# Altium schematic sheet XILINX ARTIX-7 FPGA A704 Motherboard_CON.SchDoc
size 420 x 297 mm
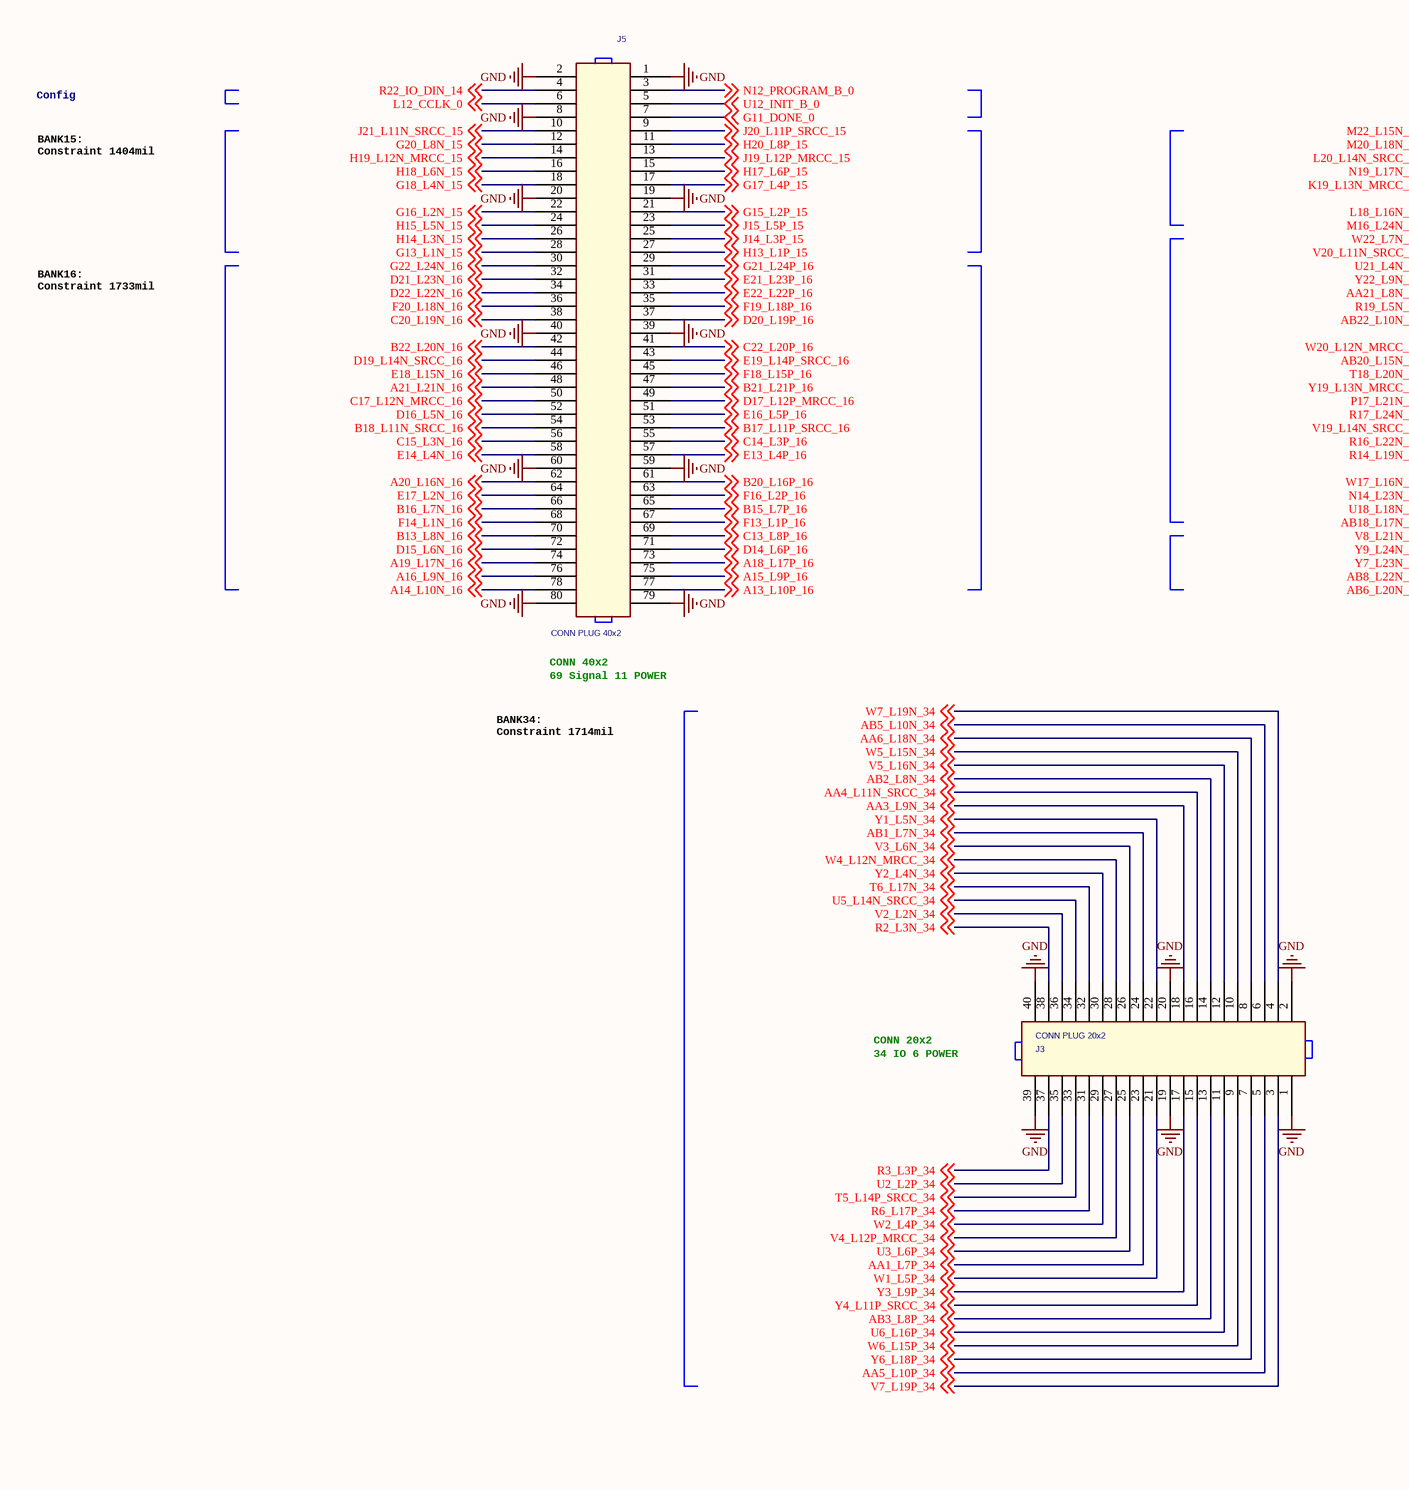
[diagram p0: XILINX ARTIX-7 FPGA A704 Motherboard_CON.SchDoc, left]
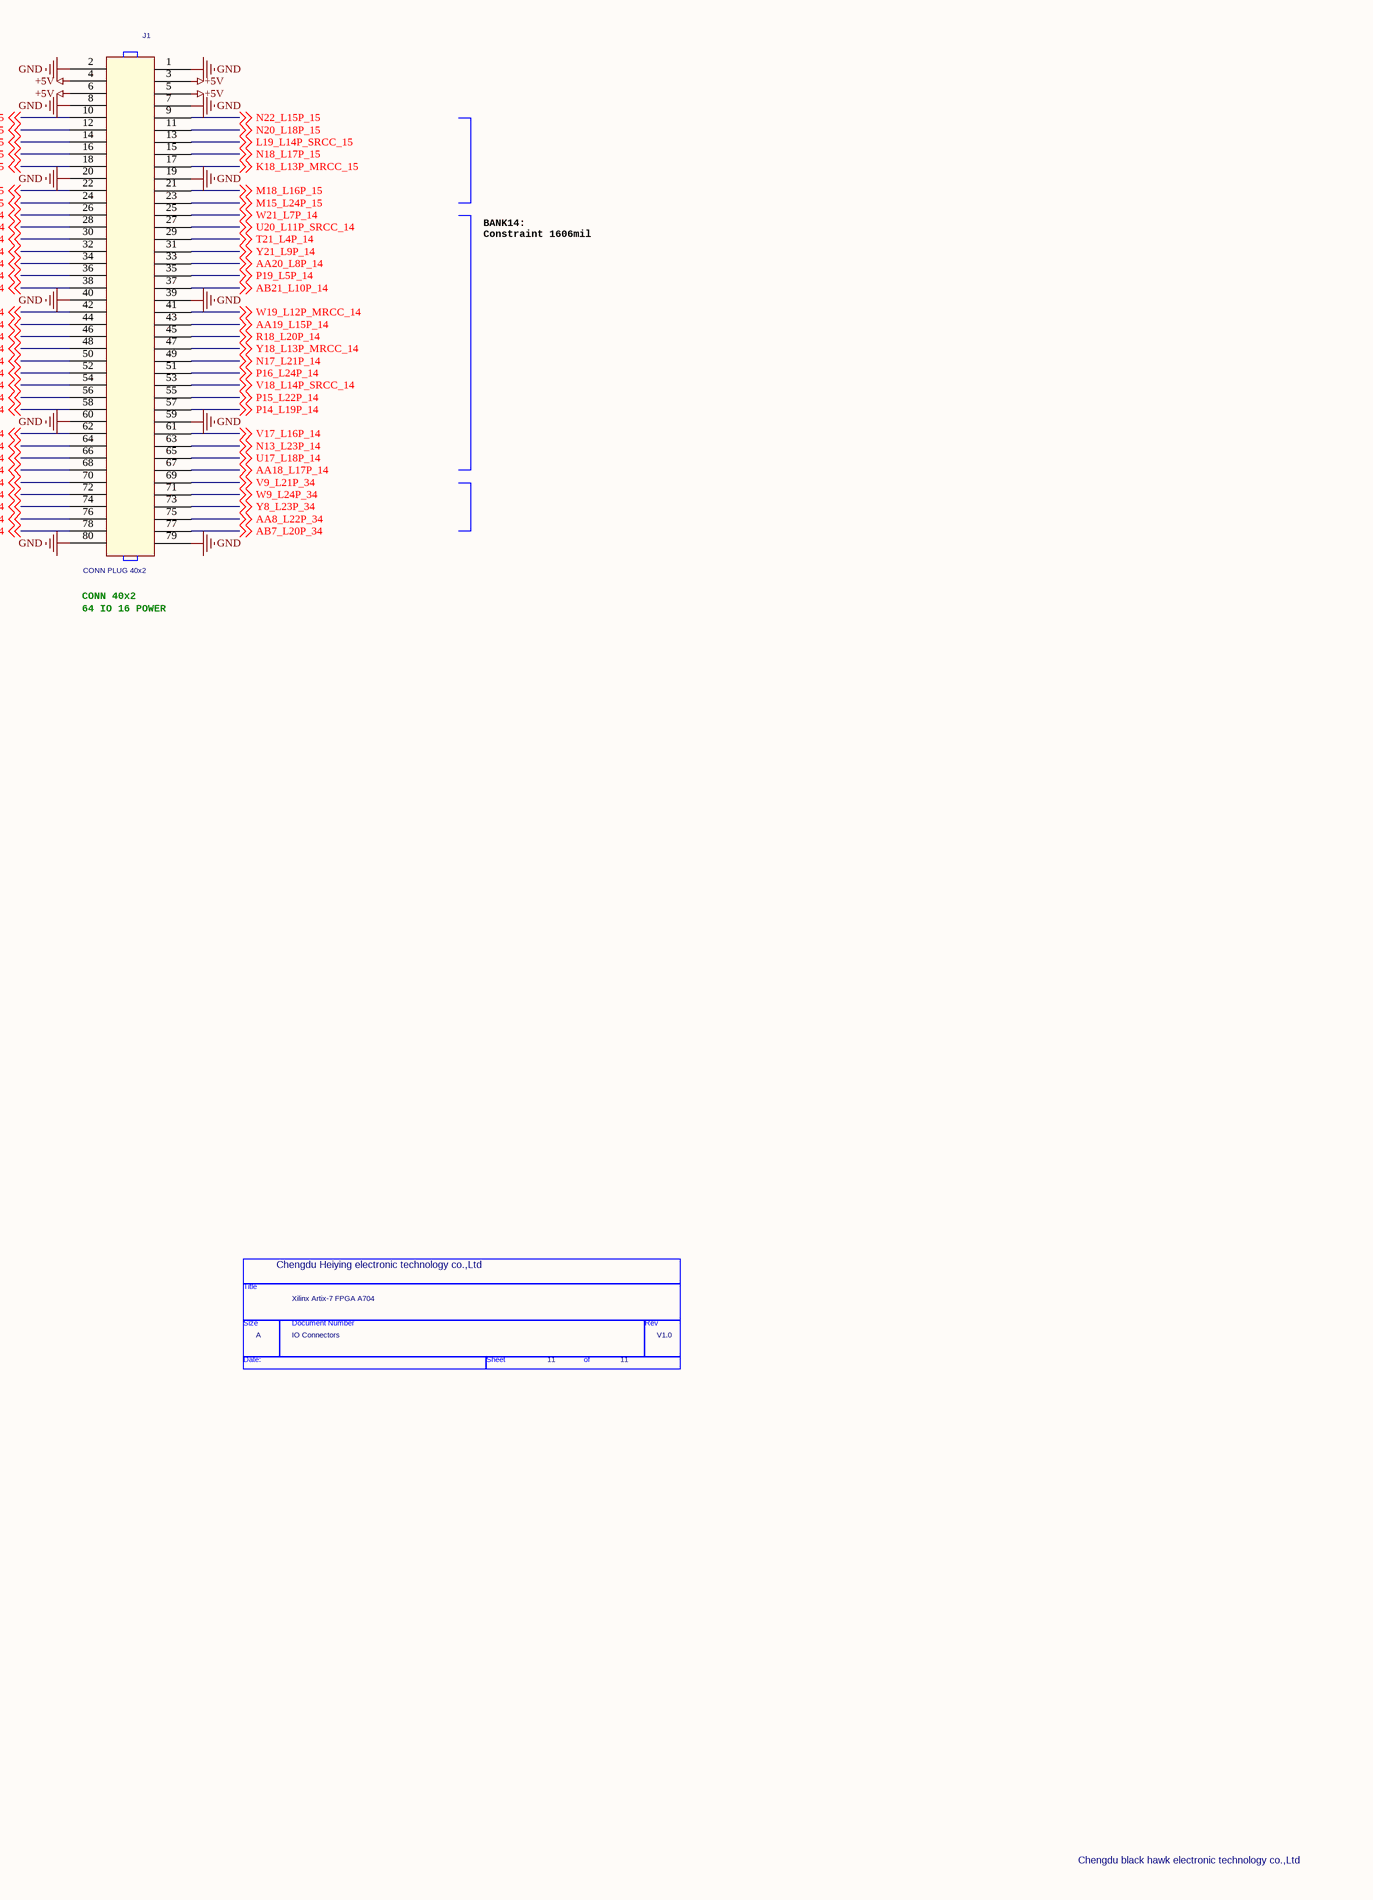
[diagram p1: XILINX ARTIX-7 FPGA A704 Motherboard_CON.SchDoc, right]

## Parts
*  Doc: IO Connectors  RevCode: V1.0  Title: Xilinx Artix-7 FPGA A704  Page Size: A  Page Number: 11  (hidden comment: TitleBlock0)  (graphical)
J1  CONN PLUG 40x2  [HDR2X40_2P0]
J3  CONN PLUG 20x2  [HDR2X20_2P0]
J5  CONN PLUG 40x2  [HDR2X40_2P0]

## Nets
+5V: J1.3 J1.4 J1.5 J1.6
GND: J1.1 J1.2 J1.7 J1.8 J1.19 J1.20 J1.39 J1.40 J1.59 J1.60 J1.79 J1.80 J3.1 J3.2 J3.19 J3.20 J3.39 J3.40 J5.1 J5.2 J5.8 J5.19 J5.20 J5.39 J5.40 J5.59 J5.60 J5.79 J5.80
A13_L10P_16: J5.77 ; off-sheet A13_L10P_16
A14_L10N_16: J5.78 ; off-sheet A14_L10N_16
A15_L9P_16: J5.75 ; off-sheet A15_L9P_16
A16_L9N_16: J5.76 ; off-sheet A16_L9N_16
A18_L17P_16: J5.73 ; off-sheet A18_L17P_16
A19_L17N_16: J5.74 ; off-sheet A19_L17N_16
A20_L16N_16: J5.62 ; off-sheet A20_L16N_16
A21_L21N_16: J5.48 ; off-sheet A21_L21N_16
AA1_L7P_34: J3.23 ; off-sheet AA1_L7P_34
AA3_L9N_34: J3.18 ; off-sheet AA3_L9N_34
AA4_L11N_SRCC_34: J3.16 ; off-sheet AA4_L11N_SRCC_34
AA5_L10P_34: J3.5 ; off-sheet AA5_L10P_34
AA6_L18N_34: J3.8 ; off-sheet AA6_L18N_34
AA8_L22P_34: J1.75 ; off-sheet AA8_L22P_34
AA18_L17P_14: J1.67 ; off-sheet AA18_L17P_14
AA19_L15P_14: J1.43 ; off-sheet AA19_L15P_14
AA20_L8P_14: J1.33 ; off-sheet AA20_L8P_14
AA21_L8N_14: J1.34 ; off-sheet AA21_L8N_14
AB1_L7N_34: J3.24 ; off-sheet AB1_L7N_34
AB2_L8N_34: J3.14 ; off-sheet AB2_L8N_34
AB3_L8P_34: J3.13 ; off-sheet AB3_L8P_34
AB5_L10N_34: J3.6 ; off-sheet AB5_L10N_34
AB6_L20N_34: J1.78 ; off-sheet AB6_L20N_34
AB7_L20P_34: J1.77 ; off-sheet AB7_L20P_34
AB8_L22N_34: J1.76 ; off-sheet AB8_L22N_34
AB18_L17N_14: J1.68 ; off-sheet AB18_L17N_14
AB20_L15N_14: J1.44 ; off-sheet AB20_L15N_14
AB21_L10P_14: J1.37 ; off-sheet AB21_L10P_14
AB22_L10N_14: J1.38 ; off-sheet AB22_L10N_14
B13_L8N_16: J5.70 ; off-sheet B13_L8N_16
B15_L7P_16: J5.65 ; off-sheet B15_L7P_16
B16_L7N_16: J5.66 ; off-sheet B16_L7N_16
B17_L11P_SRCC_16: J5.53 ; off-sheet B17_L11P_SRCC_16
B18_L11N_SRCC_16: J5.54 ; off-sheet B18_L11N_SRCC_16
B20_L16P_16: J5.61 ; off-sheet B20_L16P_16
B21_L21P_16: J5.47 ; off-sheet B21_L21P_16
B22_L20N_16: J5.42 ; off-sheet B22_L20N_16
C13_L8P_16: J5.69 ; off-sheet C13_L8P_16
C14_L3P_16: J5.55 ; off-sheet C14_L3P_16
C15_L3N_16: J5.56 ; off-sheet C15_L3N_16
C17_L12N_MRCC_16: J5.50 ; off-sheet C17_L12N_MRCC_16
C20_L19N_16: J5.38 ; off-sheet C20_L19N_16
C22_L20P_16: J5.41 ; off-sheet C22_L20P_16
D14_L6P_16: J5.71 ; off-sheet D14_L6P_16
D15_L6N_16: J5.72 ; off-sheet D15_L6N_16
D16_L5N_16: J5.52 ; off-sheet D16_L5N_16
D17_L12P_MRCC_16: J5.49 ; off-sheet D17_L12P_MRCC_16
D19_L14N_SRCC_16: J5.44 ; off-sheet D19_L14N_SRCC_16
D20_L19P_16: J5.37 ; off-sheet D20_L19P_16
D21_L23N_16: J5.32 ; off-sheet D21_L23N_16
D22_L22N_16: J5.34 ; off-sheet D22_L22N_16
E13_L4P_16: J5.57 ; off-sheet E13_L4P_16
E14_L4N_16: J5.58 ; off-sheet E14_L4N_16
E16_L5P_16: J5.51 ; off-sheet E16_L5P_16
E17_L2N_16: J5.64 ; off-sheet E17_L2N_16
E18_L15N_16: J5.46 ; off-sheet E18_L15N_16
E19_L14P_SRCC_16: J5.43 ; off-sheet E19_L14P_SRCC_16
E21_L23P_16: J5.31 ; off-sheet E21_L23P_16
E22_L22P_16: J5.33 ; off-sheet E22_L22P_16
F13_L1P_16: J5.67 ; off-sheet F13_L1P_16
F14_L1N_16: J5.68 ; off-sheet F14_L1N_16
F16_L2P_16: J5.63 ; off-sheet F16_L2P_16
F18_L15P_16: J5.45 ; off-sheet F18_L15P_16
F19_L18P_16: J5.35 ; off-sheet F19_L18P_16
F20_L18N_16: J5.36 ; off-sheet F20_L18N_16
G11_DONE_0: J5.7 ; off-sheet G11_DONE_0
G13_L1N_15: J5.28 ; off-sheet G13_L1N_15
G15_L2P_15: J5.21 ; off-sheet G15_L2P_15
G16_L2N_15: J5.22 ; off-sheet G16_L2N_15
G17_L4P_15: J5.17 ; off-sheet G17_L4P_15
G18_L4N_15: J5.18 ; off-sheet G18_L4N_15
G20_L8N_15: J5.12 ; off-sheet G20_L8N_15
G21_L24P_16: J5.29 ; off-sheet G21_L24P_16
G22_L24N_16: J5.30 ; off-sheet G22_L24N_16
H13_L1P_15: J5.27 ; off-sheet H13_L1P_15
H14_L3N_15: J5.26 ; off-sheet H14_L3N_15
H15_L5N_15: J5.24 ; off-sheet H15_L5N_15
H17_L6P_15: J5.15 ; off-sheet H17_L6P_15
H18_L6N_15: J5.16 ; off-sheet H18_L6N_15
H19_L12N_MRCC_15: J5.14 ; off-sheet H19_L12N_MRCC_15
H20_L8P_15: J5.11 ; off-sheet H20_L8P_15
J14_L3P_15: J5.25 ; off-sheet J14_L3P_15
J15_L5P_15: J5.23 ; off-sheet J15_L5P_15
J19_L12P_MRCC_15: J5.13 ; off-sheet J19_L12P_MRCC_15
J20_L11P_SRCC_15: J5.9 ; off-sheet J20_L11P_SRCC_15
J21_L11N_SRCC_15: J5.10 ; off-sheet J21_L11N_SRCC_15
K18_L13P_MRCC_15: J1.17 ; off-sheet K18_L13P_MRCC_15
K19_L13N_MRCC_15: J1.18 ; off-sheet K19_L13N_MRCC_15
L12_CCLK_0: J5.6 ; off-sheet L12_CCLK_0
L18_L16N_15: J1.22 ; off-sheet L18_L16N_15
L19_L14P_SRCC_15: J1.13 ; off-sheet L19_L14P_SRCC_15
L20_L14N_SRCC_15: J1.14 ; off-sheet L20_L14N_SRCC_15
M15_L24P_15: J1.23 ; off-sheet M15_L24P_15
M16_L24N_15: J1.24 ; off-sheet M16_L24N_15
M18_L16P_15: J1.21 ; off-sheet M18_L16P_15
M20_L18N_15: J1.12 ; off-sheet M20_L18N_15
M22_L15N_15: J1.10 ; off-sheet M22_L15N_15
N12_PROGRAM_B_0: J5.3 ; off-sheet N12_PROGRAM_B_0
N13_L23P_14: J1.63 ; off-sheet N13_L23P_14
N14_L23N_14: J1.64 ; off-sheet N14_L23N_14
N17_L21P_14: J1.49 ; off-sheet N17_L21P_14
N18_L17P_15: J1.15 ; off-sheet N18_L17P_15
N19_L17N_15: J1.16 ; off-sheet N19_L17N_15
N20_L18P_15: J1.11 ; off-sheet N20_L18P_15
N22_L15P_15: J1.9 ; off-sheet N22_L15P_15
P14_L19P_14: J1.57 ; off-sheet P14_L19P_14
P15_L22P_14: J1.55 ; off-sheet P15_L22P_14
P16_L24P_14: J1.51 ; off-sheet P16_L24P_14
P17_L21N_14: J1.50 ; off-sheet P17_L21N_14
P19_L5P_14: J1.35 ; off-sheet P19_L5P_14
R2_L3N_34: J3.38 ; off-sheet R2_L3N_34
R3_L3P_34: J3.37 ; off-sheet R3_L3P_34
R6_L17P_34: J3.31 ; off-sheet R6_L17P_34
R14_L19N_14: J1.58 ; off-sheet R14_L19N_14
R16_L22N_14: J1.56 ; off-sheet R16_L22N_14
R17_L24N_14: J1.52 ; off-sheet R17_L24N_14
R18_L20P_14: J1.45 ; off-sheet R18_L20P_14
R19_L5N_14: J1.36 ; off-sheet R19_L5N_14
R22_IO_DIN_14: J5.4 ; off-sheet R22_IO_DIN_14
T5_L14P_SRCC_34: J3.33 ; off-sheet T5_L14P_SRCC_34
T6_L17N_34: J3.32 ; off-sheet T6_L17N_34
T18_L20N_14: J1.46 ; off-sheet T18_L20N_14
T21_L4P_14: J1.29 ; off-sheet T21_L4P_14
U2_L2P_34: J3.35 ; off-sheet U2_L2P_34
U3_L6P_34: J3.25 ; off-sheet U3_L6P_34
U5_L14N_SRCC_34: J3.34 ; off-sheet U5_L14N_SRCC_34
U6_L16P_34: J3.11 ; off-sheet U6_L16P_34
U12_INIT_B_0: J5.5 ; off-sheet U12_INIT_B_0
U17_L18P_14: J1.65 ; off-sheet U17_L18P_14
U18_L18N_14: J1.66 ; off-sheet U18_L18N_14
U20_L11P_SRCC_14: J1.27 ; off-sheet U20_L11P_SRCC_14
U21_L4N_14: J1.30 ; off-sheet U21_L4N_14
V2_L2N_34: J3.36 ; off-sheet V2_L2N_34
V3_L6N_34: J3.26 ; off-sheet V3_L6N_34
V4_L12P_MRCC_34: J3.27 ; off-sheet V4_L12P_MRCC_34
V5_L16N_34: J3.12 ; off-sheet V5_L16N_34
V7_L19P_34: J3.3 ; off-sheet V7_L19P_34
V8_L21N_34: J1.70 ; off-sheet V8_L21N_34
V9_L21P_34: J1.69 ; off-sheet V9_L21P_34
V17_L16P_14: J1.61 ; off-sheet V17_L16P_14
V18_L14P_SRCC_14: J1.53 ; off-sheet V18_L14P_SRCC_14
V19_L14N_SRCC_14: J1.54 ; off-sheet V19_L14N_SRCC_14
V20_L11N_SRCC_14: J1.28 ; off-sheet V20_L11N_SRCC_14
W1_L5P_34: J3.21 ; off-sheet W1_L5P_34
W2_L4P_34: J3.29 ; off-sheet W2_L4P_34
W4_L12N_MRCC_34: J3.28 ; off-sheet W4_L12N_MRCC_34
W5_L15N_34: J3.10 ; off-sheet W5_L15N_34
W6_L15P_34: J3.9 ; off-sheet W6_L15P_34
W7_L19N_34: J3.4 ; off-sheet W7_L19N_34
W9_L24P_34: J1.71 ; off-sheet W9_L24P_34
W17_L16N_14: J1.62 ; off-sheet W17_L16N_14
W19_L12P_MRCC_14: J1.41 ; off-sheet W19_L12P_MRCC_14
W20_L12N_MRCC_14: J1.42 ; off-sheet W20_L12N_MRCC_14
W21_L7P_14: J1.25 ; off-sheet W21_L7P_14
W22_L7N_14: J1.26 ; off-sheet W22_L7N_14
Y1_L5N_34: J3.22 ; off-sheet Y1_L5N_34
Y2_L4N_34: J3.30 ; off-sheet Y2_L4N_34
Y3_L9P_34: J3.17 ; off-sheet Y3_L9P_34
Y4_L11P_SRCC_34: J3.15 ; off-sheet Y4_L11P_SRCC_34
Y6_L18P_34: J3.7 ; off-sheet Y6_L18P_34
Y7_L23N_34: J1.74 ; off-sheet Y7_L23N_34
Y8_L23P_34: J1.73 ; off-sheet Y8_L23P_34
Y9_L24N_34: J1.72 ; off-sheet Y9_L24N_34
Y18_L13P_MRCC_14: J1.47 ; off-sheet Y18_L13P_MRCC_14
Y19_L13N_MRCC_14: J1.48 ; off-sheet Y19_L13N_MRCC_14
Y21_L9P_14: J1.31 ; off-sheet Y21_L9P_14
Y22_L9N_14: J1.32 ; off-sheet Y22_L9N_14

## Notes on the sheet
- Config
- BANK15:
  Constraint 1404mil
- BANK16:
  Constraint 1733mil
- BANK14:
  Constraint 1606mil
- CONN 40x2
- BANK34:
  Constraint 1714mil
- 69 Signal 11 POWER
- 64 IO 16 POWER
- 34 IO 6 POWER
- CONN 20x2
- (near *) Chengdu Heiying electronic technology co.,Ltd
- Chengdu black hawk electronic technology co.,Ltd
- (in symbol TitleBlock0) Title; Size; Document Number; Rev; Date:; Sheet; of

## Library data of the parts
J3 = CONN PLUG 20x2_0
* = TitleBlock0: Page Create Date: March  8, 1995; Page Count: 11; Schematic Page Count: 11; Schematic Page Number: 11